# Altium schematic sheet Supplies.SchDoc
size A
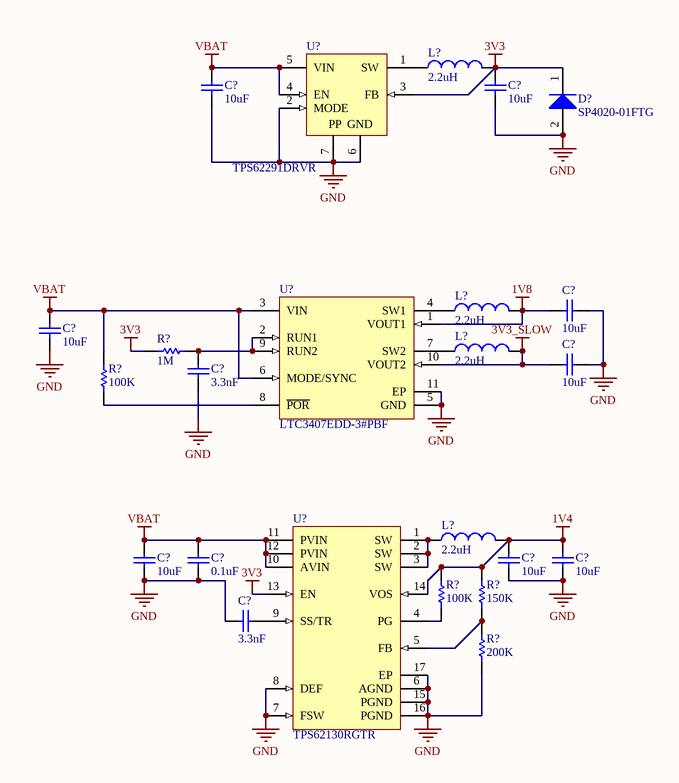
[diagram p0: Supplies.SchDoc]

## Parts
(Parts that share a designator on the sheet are numbered #1, #2 ... from top to bottom, then left to right.)
C?#1  value 10uF  [C0402[1005X55]]  (hidden comment: 10uF 6.3V 0402)
C?#2  value 10uF  [C0402[1005X55]]  (hidden comment: 10uF 6.3V 0402)
C?#3  value 10uF  [C0402[1005X55]]  (hidden comment: 10uF 6.3V 0402)
C?#4  value 10uF  [C0402[1005X55]]  (hidden comment: 10uF 6.3V 0402)
C?#5  value 10uF  [C0402[1005X55]]  (hidden comment: 10uF 6.3V 0402)
C?#6  value 3.3nF  [C0402[1005X55]]  (hidden comment: 3.3nF 50V 0402)
C?#7  value 10uF  [C0402[1005X55]]  (hidden comment: 10uF 6.3V 0402)
C?#8  value 0.1uF  [C0402[1005X55]]  (hidden comment: 0.1uF 6.3V 0402)
C?#9  value 10uF  [C0402[1005X55]]  (hidden comment: 10uF 6.3V 0402)
C?#10  value 10uF  [C0402[1005X55]]  (hidden comment: 10uF 6.3V 0402)
C?#11  value 3.3nF  [C0402[1005X55]]  (hidden comment: 3.3nF 50V 0402)
D?  SP4020-01FTG  [SOD323]
L?#1  2.2uH  [IND0805]
L?#2  2.2uH  [IND0603]
L?#3  2.2uH  [IND0603]
L?#4  2.2uH  [IND1008]
R?#1  value 1M  [R0402[1005]]  (hidden comment: 1M 1% 0402)
R?#2  value 100K  [R0402[1005]]  (hidden comment: 100K 1% 0402)
R?#3  value 100K  [R0402[1005]]  (hidden comment: 100K 1% 0402)
R?#4  value 150K  [R0402[1005]]  (hidden comment: 150K 1% 0402)
R?#5  value 200K  [R0402[1005]]  (hidden comment: 200K 1% 0402)
U?#1  TPS62291DRVR  [WSON-6]
U?#2  LTC3407EDD-3#PBF  [LT-DD-10_V]
U?#3  TPS62130RGTR  [RGT0016C_V]

## Nets
1V4: C?#9.2 C?#10.2 L?#4.2 R?#3.2 R?#4.2 U?#3.14(VOS)
1V8: C?#3.2 L?#2.2 U?#2.1(VOUT1)
3V3: C?#2.2 D?.1(K) L?#1.2 R?#1.2 U?#1.3(FB) U?#3.13(EN)
3V3_SLOW: C?#5.1 L?#3.2 U?#2.10(VOUT2)
GND: C?#1.1 C?#2.1 C?#3.1 C?#4.1 C?#5.2 C?#6.1 C?#7.1 C?#8.1 C?#9.1 C?#10.1 C?#11.1 D?.2(A) R?#5.1 U?#1.2(MODE) U?#1.6(GND) U?#1.7(EP) U?#2.5(GND) U?#2.11(EP) U?#3.6(AGND) U?#3.7(FSW) U?#3.8(DEF) U?#3.15(PGND) U?#3.16(PGND) U?#3.17(EP)
VBAT: C?#1.2 C?#4.2 C?#7.2 C?#8.2 R?#2.2 U?#1.4(EN) U?#1.5(VIN) U?#2.3(VIN) U?#2.6(MODE/SYNC) U?#3.10(AVIN) U?#3.11(PVIN) U?#3.12(PVIN)
NetC?#6_2: C?#6.2 R?#1.1 U?#2.2(RUN1) U?#2.9(RUN2)
NetC?#11_2: C?#11.2 U?#3.9(SS/TR)
NetL?#1_1: L?#1.1 U?#1.1(SW)
NetL?#2_1: L?#2.1 U?#2.4(SW1)
NetL?#3_1: L?#3.1 U?#2.7(SW2)
NetL?#4_1: L?#4.1 U?#3.1(SW) U?#3.2(SW) U?#3.3(SW)
NetR?#2_1: R?#2.1 U?#2.8(~{POR})
NetR?#3_1: R?#3.1 U?#3.4(PG)
NetR?#4_1: R?#4.1 R?#5.2 U?#3.5(FB)

## Notes on the sheet
- (in symbol TPS62291DRVR) PP

## Library data of the parts
C?#1-C?#5 C?#7 C?#9 C?#10 = CAP_10uF_6.3V_0402_20%: 10uF 6.3V 20% 0402 (1005 Metric); PartNumber: GRM155R60J106ME44D; Manufacturer: Murata; Tolerance: 20%; Mounting Technology: Surface Mount; PackageReference: 0402; PackageDescription: 0402 (1005 Metric); Voltage: 6.3V
C?#6 C?#11 = CAP_3.3nF_50V_0402_10%: 3.3nF 50V 10% 0402 (1005 Metric); PartNumber: GRM155R71H332KA01D; Manufacturer: Murata; Mounting Technology: Surface Mount; PackageReference: 0402; PackageDescription: 0402 (1005 Metric); Voltage: 50V; Tolerance: 10%
C?#8 = CAP_0.1uF_6.3V_0402_10%: 0.1uF 6.3V 10% 0402 (1005 Metric); PartNumber: GRM155R70J104KA01D; Manufacturer: Murata; Mounting Technology: Surface Mount; PackageReference: 0402; PackageDescription: 0402 (1005 Metric); Voltage: 6.3V; Tolerance: 10%
D? = SP4020-01FTG: Manufacturer: Littelfuse; PartNumber: SP4020-01FTG; PackageReference: SOD-323-2; Mounting Technology: Surface Mount
L?#1 = IND_2.2uH_1.7A_0805_20%: 2.2uH 20% 1.7A 0805; PartNumber: LQM21PN2R2MGHL; Manufacturer: Murata; PackageReference: 0805; PackageDescription: 0805 (2012 metric); Value: 2.2uH; Mounting Technology: Surface Mount; Current: 1.7A
L?#2 L?#3 = IND_2.2uH_750mA_0603_20%: 2.2uH 20% 750mA 0603; PartNumber: LQM18PZ2R2MCHD; Manufacturer: Murata; PackageReference: 0603; PackageDescription: 0603 (1608 metric); Value: 2.2uH; Mounting Technology: Surface Mount; Current: 750mA
L?#4 = IND_2.2uH_3.3A_1008_20%: 2.2uH 20% 3.3A 1008; PartNumber: DFE252012F-2R2M=P2; Manufacturer: Murata; PackageReference: 1008; PackageDescription: 1008 (2520 metric); Mounting Technology: Surface Mount; Current: 3.3A; Value: 2.2uH
R?#1 = RES_1M_0402_1%: 1M 0.063W 1% 0402 (1005 Metric); Manufacturer: KOA Speer; PartNumber: RK73H1ETTP1004F; Tolerance: 1%; Power: 0.063W; Mounting Technology: Surface Mount; PackageReference: 0402; PackageDescription: 0402 (1005 Metric); ComponentLink1Description: Datasheet; ComponentLink1URL: http://www.koaspeer.com/catimages/Products/RK73H/RK73H.pdf
R?#2 R?#3 = RES_100K_0402_1%: 100K 0.063W 1% 0402 (1005 Metric); Manufacturer: KOA Speer; PartNumber: RK73H1ETTP1003F; Tolerance: 1%; Power: 0.063W; Mounting Technology: Surface Mount; PackageReference: 0402; PackageDescription: 0402 (1005 Metric); ComponentLink1Description: Datasheet; ComponentLink1URL: http://www.koaspeer.com/catimages/Products/RK73H/RK73H.pdf
R?#4 = RES_150K_0402_1%: 150K 0.063W 1% 0402 (1005 Metric); Manufacturer: KOA Speer; PartNumber: RK73H1ETTP1503F; Tolerance: 1%; Power: 0.063W; Mounting Technology: Surface Mount; PackageReference: 0402; PackageDescription: 0402 (1005 Metric); ComponentLink1Description: Datasheet; ComponentLink1URL: http://www.koaspeer.com/catimages/Products/RK73H/RK73H.pdf
R?#5 = RES_200K_0402_1%: 200K 0.063W 1% 0402 (1005 Metric); Manufacturer: KOA Speer; PartNumber: RK73H1ETTP2003F; Tolerance: 1%; Power: 0.063W; Mounting Technology: Surface Mount; PackageReference: 0402; PackageDescription: 0402 (1005 Metric); ComponentLink1Description: Datasheet; ComponentLink1URL: http://www.koaspeer.com/catimages/Products/RK73H/RK73H.pdf
U?#1 = TPS62291DRVR: Voltage Regulators - Switching Regulators 2.25MHz 1A Step-Down Cnvrtr 3.3V Output; Manufacturer: Texas Instruments; PartNumber: TPS62291DRVR; PackageReference: WSON-6; PackageDescription: SON, 6-Leads, Body 2x2mm, Pitch 0.65mm, Thermal Pad 1.6x1mm, TI Recommended; Mounting Technology: Surface Mount
U?#2 = CMP-0492-00137-1: Dual Synchronous 800 mA, 2.25 MHz Step-Down DC/DC Regulator, 10-pin SON (DD-10), -40 to 85 degC, Pb-Free; Manufacturer: Linear Technology; Number of Outputs: 2; DatasheetVersion: Rev. B; ComponentLink1URL: http://www.linear.com/; PackageDescription: 10-Pin Plastic DFN, Body 3 x 3 mm, Pitch 0.5 mm; PartNumber: LTC3407EDD-3#PBF; ComponentLink3Description: Package Specification; PackageVersion: Rev. C, 06/2010; ComponentLink2Description: Datasheet; Frequency Sync Range: 2.25MHz; ComponentLink2URL: http://cds.linear.com/docs/en/datasheet/34073fb.pdf; Code_JEDEC: MO-229; RoHS: TRUE; ComponentLink3URL: http://cds.linear.com/docs/en/packaging/DFN_10_05-08-1699.pdf; ComponentLink1Description: Manufacturer URL; PackageReference: DD-10; Mounting Technology: Surface Mount
U?#3 = CMP-0323-00115-3: Buck Step Down Regulator with 3 to 17 V Input and 0.9 to 6 V Output, -40 to 85 degC, 16-Pin QFN (RGT), Green (RoHS & no Sb/Br); Manufacturer: Texas Instruments; Rating: Catalog; Vout(Max)(V): 6; Vin(Min)(V): 3; Switch Current Limit(Typ)(A): 4.2; Iq(Typ)(mA): 0.017; Regulated Outputs(#): 1; Synchronous Rectification: TRUE; SubFamily: Step-Down Regulator; Vin(Max)(V): 17; Duty Cycle(Max)(%): 100; Vout(Min)(V): 0.9; ComponentLink2URL: http://www.ti.com/litv/pdf/mpqf119g; Eco-Plan: Green (RoHS & no Sb/Br); PartNumber: TPS62130RGTR; ComponentLink1Description: Datasheet; DatasheetVersion: SLVSAG7; Mounting Technology: Surface Mount; Iout(Max)(A): 3; ComponentLink2Description: Package Specification; Code_JEDEC: MO-220; Topology: Buck; ComponentLink1URL: http://www.ti.com/general/docs/lit/getliterature.tsp?genericPartNumber=TPS62130&fileType=pdf; ComponentLink3URL: Samples URL:http://www.ti.com/product/tps62130#samples; ComponentLink3Description: URL Link1; PackageReference: RGT0016C; PackageVersion: revH, Oct-2011; PackageDescription: 16-Pin Plastic Quad Flat No-Lead, 3 x 3 mm Body, 0.5 mm Pitch, 1.7 x 1.7 mm Exposed Pad